# Altium schematic sheet PLWD_Top_Sheet.SchDoc
size A4; SheetNumber: 1; SheetTotal: 3
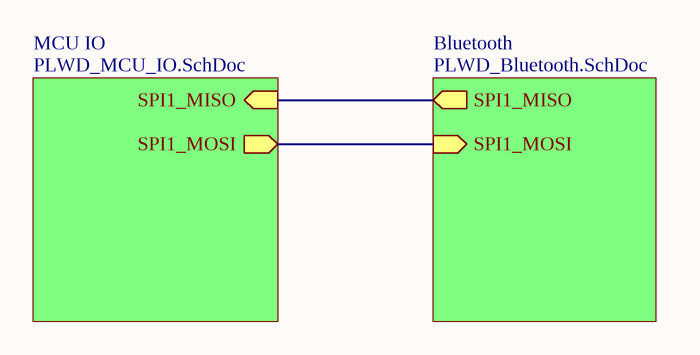
[diagram p0: PLWD_Top_Sheet.SchDoc]

## Sub-sheets
Bluetooth = PLWD_Bluetooth.SchDoc: SPI1_MISO (out), SPI1_MOSI (in)
MCU IO = PLWD_MCU_IO.SchDoc: SPI1_MISO (in), SPI1_MOSI (out)

## Nets
(unnamed): sheet MCU IO/SPI1_MISO, sheet Bluetooth/SPI1_MISO
(unnamed): sheet MCU IO/SPI1_MOSI, sheet Bluetooth/SPI1_MOSI